# Altium project BatteryLED.PrjPCB
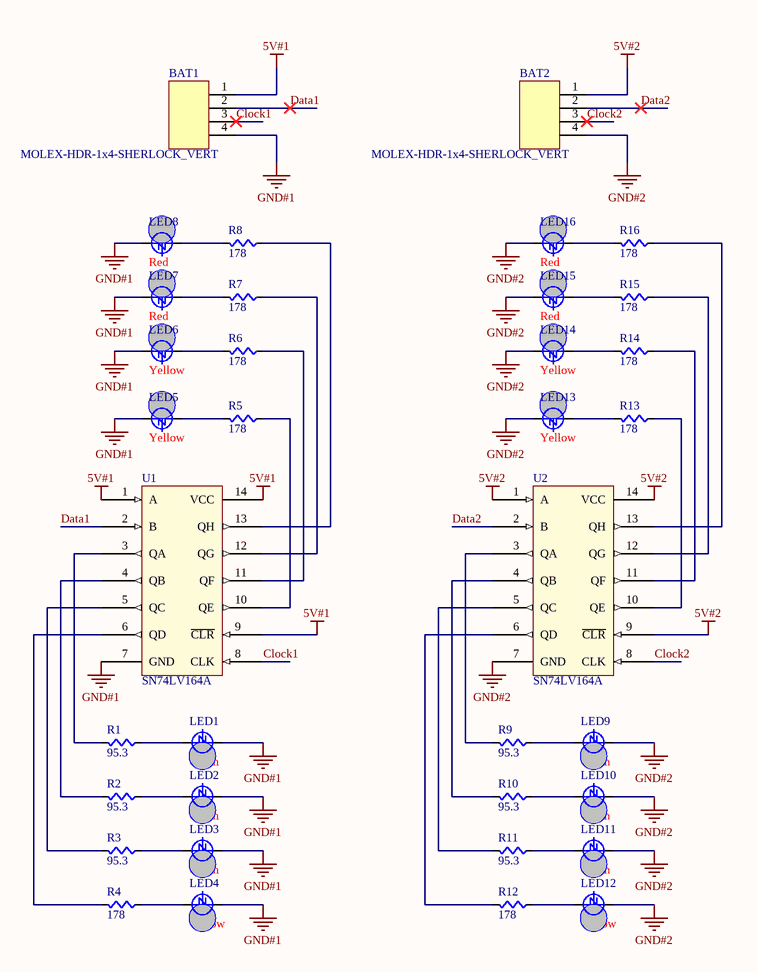
[diagram p0: BatteryLED.SchDoc]
1 sheet, 36 parts. Net scope: global (net labels, ports and power ports of the same name join across sheets).
Board file: BatteryLED.PcbDoc

## Sheet BatteryLED.SchDoc
size A

### Parts
BAT1  MOLEX-HDR-1x4-SHERLOCK_VERT  [MOLEX-HDR-1X4-SHERLOCK-VERT]
BAT2  MOLEX-HDR-1x4-SHERLOCK_VERT  [MOLEX-HDR-1X4-SHERLOCK-VERT]
LED1  Color: Green  [LED0805]  (hidden comment: LED)
LED2  Color: Green  [LED0805]  (hidden comment: LED)
LED3  Color: Green  [LED0805]  (hidden comment: LED)
LED4  Color: Yellow  [LED0805]  (hidden comment: LED)
LED5  Color: Yellow  [LED0805]  (hidden comment: LED)
LED6  Color: Yellow  [LED0805]  (hidden comment: LED)
LED7  Color: Red  [LED0805]  (hidden comment: LED)
LED8  Color: Red  [LED0805]  (hidden comment: LED)
LED9  Color: Green  [LED0805]  (hidden comment: LED)
LED10  Color: Green  [LED0805]  (hidden comment: LED)
LED11  Color: Green  [LED0805]  (hidden comment: LED)
LED12  Color: Yellow  [LED0805]  (hidden comment: LED)
LED13  Color: Yellow  [LED0805]  (hidden comment: LED)
LED14  Color: Yellow  [LED0805]  (hidden comment: LED)
LED15  Color: Red  [LED0805]  (hidden comment: LED)
LED16  Color: Red  [LED0805]  (hidden comment: LED)
R1  value 95.3  [RES0603]  (hidden comment: Res)
R2  value 95.3  [RES0603]  (hidden comment: Res)
R3  value 95.3  [RES0603]  (hidden comment: Res)
R4  value 178  [RES0603]  (hidden comment: Res)
R5  value 178  [RES0603]  (hidden comment: Res)
R6  value 178  [RES0603]  (hidden comment: Res)
R7  value 178  [RES0603]  (hidden comment: Res)
R8  value 178  [RES0603]  (hidden comment: Res)
R9  value 95.3  [RES0603]  (hidden comment: Res)
R10  value 95.3  [RES0603]  (hidden comment: Res)
R11  value 95.3  [RES0603]  (hidden comment: Res)
R12  value 178  [RES0603]  (hidden comment: Res)
R13  value 178  [RES0603]  (hidden comment: Res)
R14  value 178  [RES0603]  (hidden comment: Res)
R15  value 178  [RES0603]  (hidden comment: Res)
R16  value 178  [RES0603]  (hidden comment: Res)
U1  SN74LV164A  [SN74LV164AD]
U2  SN74LV164A  [SN74LV164AD]

### Nets
5V#1: BAT1.1 U1.1(A) U1.9(~{CLR}) U1.14(VCC)
5V#2: BAT2.1 U2.1(A) U2.9(~{CLR}) U2.14(VCC)
GND#1: BAT1.4 LED1.C LED2.C LED3.C LED4.C LED5.C LED6.C LED7.C LED8.C U1.7(GND)
GND#2: BAT2.4 LED9.C LED10.C LED11.C LED12.C LED13.C LED14.C LED15.C LED16.C U2.7(GND)
Clock1: BAT1.3 U1.8(CLK)
Clock2: BAT2.3 U2.8(CLK)
Data1: BAT1.2 U1.2(B)
Data2: BAT2.2 U2.2(B)
NetLED1_A: LED1.A R1.2(B)
NetLED2_A: LED2.A R2.2(B)
NetLED3_A: LED3.A R3.2(B)
NetLED4_A: LED4.A R4.2(B)
NetLED5_A: LED5.A R5.1(A)
NetLED6_A: LED6.A R6.1(A)
NetLED7_A: LED7.A R7.1(A)
NetLED8_A: LED8.A R8.1(A)
NetLED9_A: LED9.A R9.2(B)
NetLED10_A: LED10.A R10.2(B)
NetLED11_A: LED11.A R11.2(B)
NetLED12_A: LED12.A R12.2(B)
NetLED13_A: LED13.A R13.1(A)
NetLED14_A: LED14.A R14.1(A)
NetLED15_A: LED15.A R15.1(A)
NetLED16_A: LED16.A R16.1(A)
NetR1_1: R1.1(A) U1.3(QA)
NetR2_1: R2.1(A) U1.4(QB)
NetR3_1: R3.1(A) U1.5(QC)
NetR4_1: R4.1(A) U1.6(QD)
NetR5_2: R5.2(B) U1.10(QE)
NetR6_2: R6.2(B) U1.11(QF)
NetR7_2: R7.2(B) U1.12(QG)
NetR8_2: R8.2(B) U1.13(QH)
NetR9_1: R9.1(A) U2.3(QA)
NetR10_1: R10.1(A) U2.4(QB)
NetR11_1: R11.1(A) U2.5(QC)
NetR12_1: R12.1(A) U2.6(QD)
NetR13_2: R13.2(B) U2.10(QE)
NetR14_2: R14.2(B) U2.11(QF)
NetR15_2: R15.2(B) U2.12(QG)
NetR16_2: R16.2(B) U2.13(QH)

### Library data of the parts
BAT1 BAT2 = MOLEX-HDR-1x4-SHERLOCK_VERT: Header, Molex, 2mm Pitch Sherlock Header, Single Row, Vertical, 4 Circuits, Length 3.3mm, 0353620450; Manufacturer Part Number: *; Order Part Number: *
U1 U2 = SN74LV164A: 8-Bit Parallel out Serial Shift Register; Supplier 1: Digi-Key; Supplier Part Number 1: 296-1680-5-ND
LED1-LED16 = LED: Supplier 1: Digi-Key
  LED1-LED3 LED9-LED11: Supplier Part Number 1: 754-1438-1-ND
  LED4-LED6 LED12-LED14: Supplier Part Number 1: 754-1135-1-ND
  LED7 LED8 LED15 LED16: Supplier Part Number 1: 754-1159-1-ND
R1-R16 = Res: Supplier 1: Digi-Key
  R1-R3 R9-R11: Supplier Part Number 1: 1276-4562-1-ND
  R4-R8 R12-R16: Supplier Part Number 1: 1276-4578-1-ND